# Altium schematic sheet Codec.SchDoc
size A3; DocumentNumber: 3; SheetNumber: 3; SheetTotal: 9
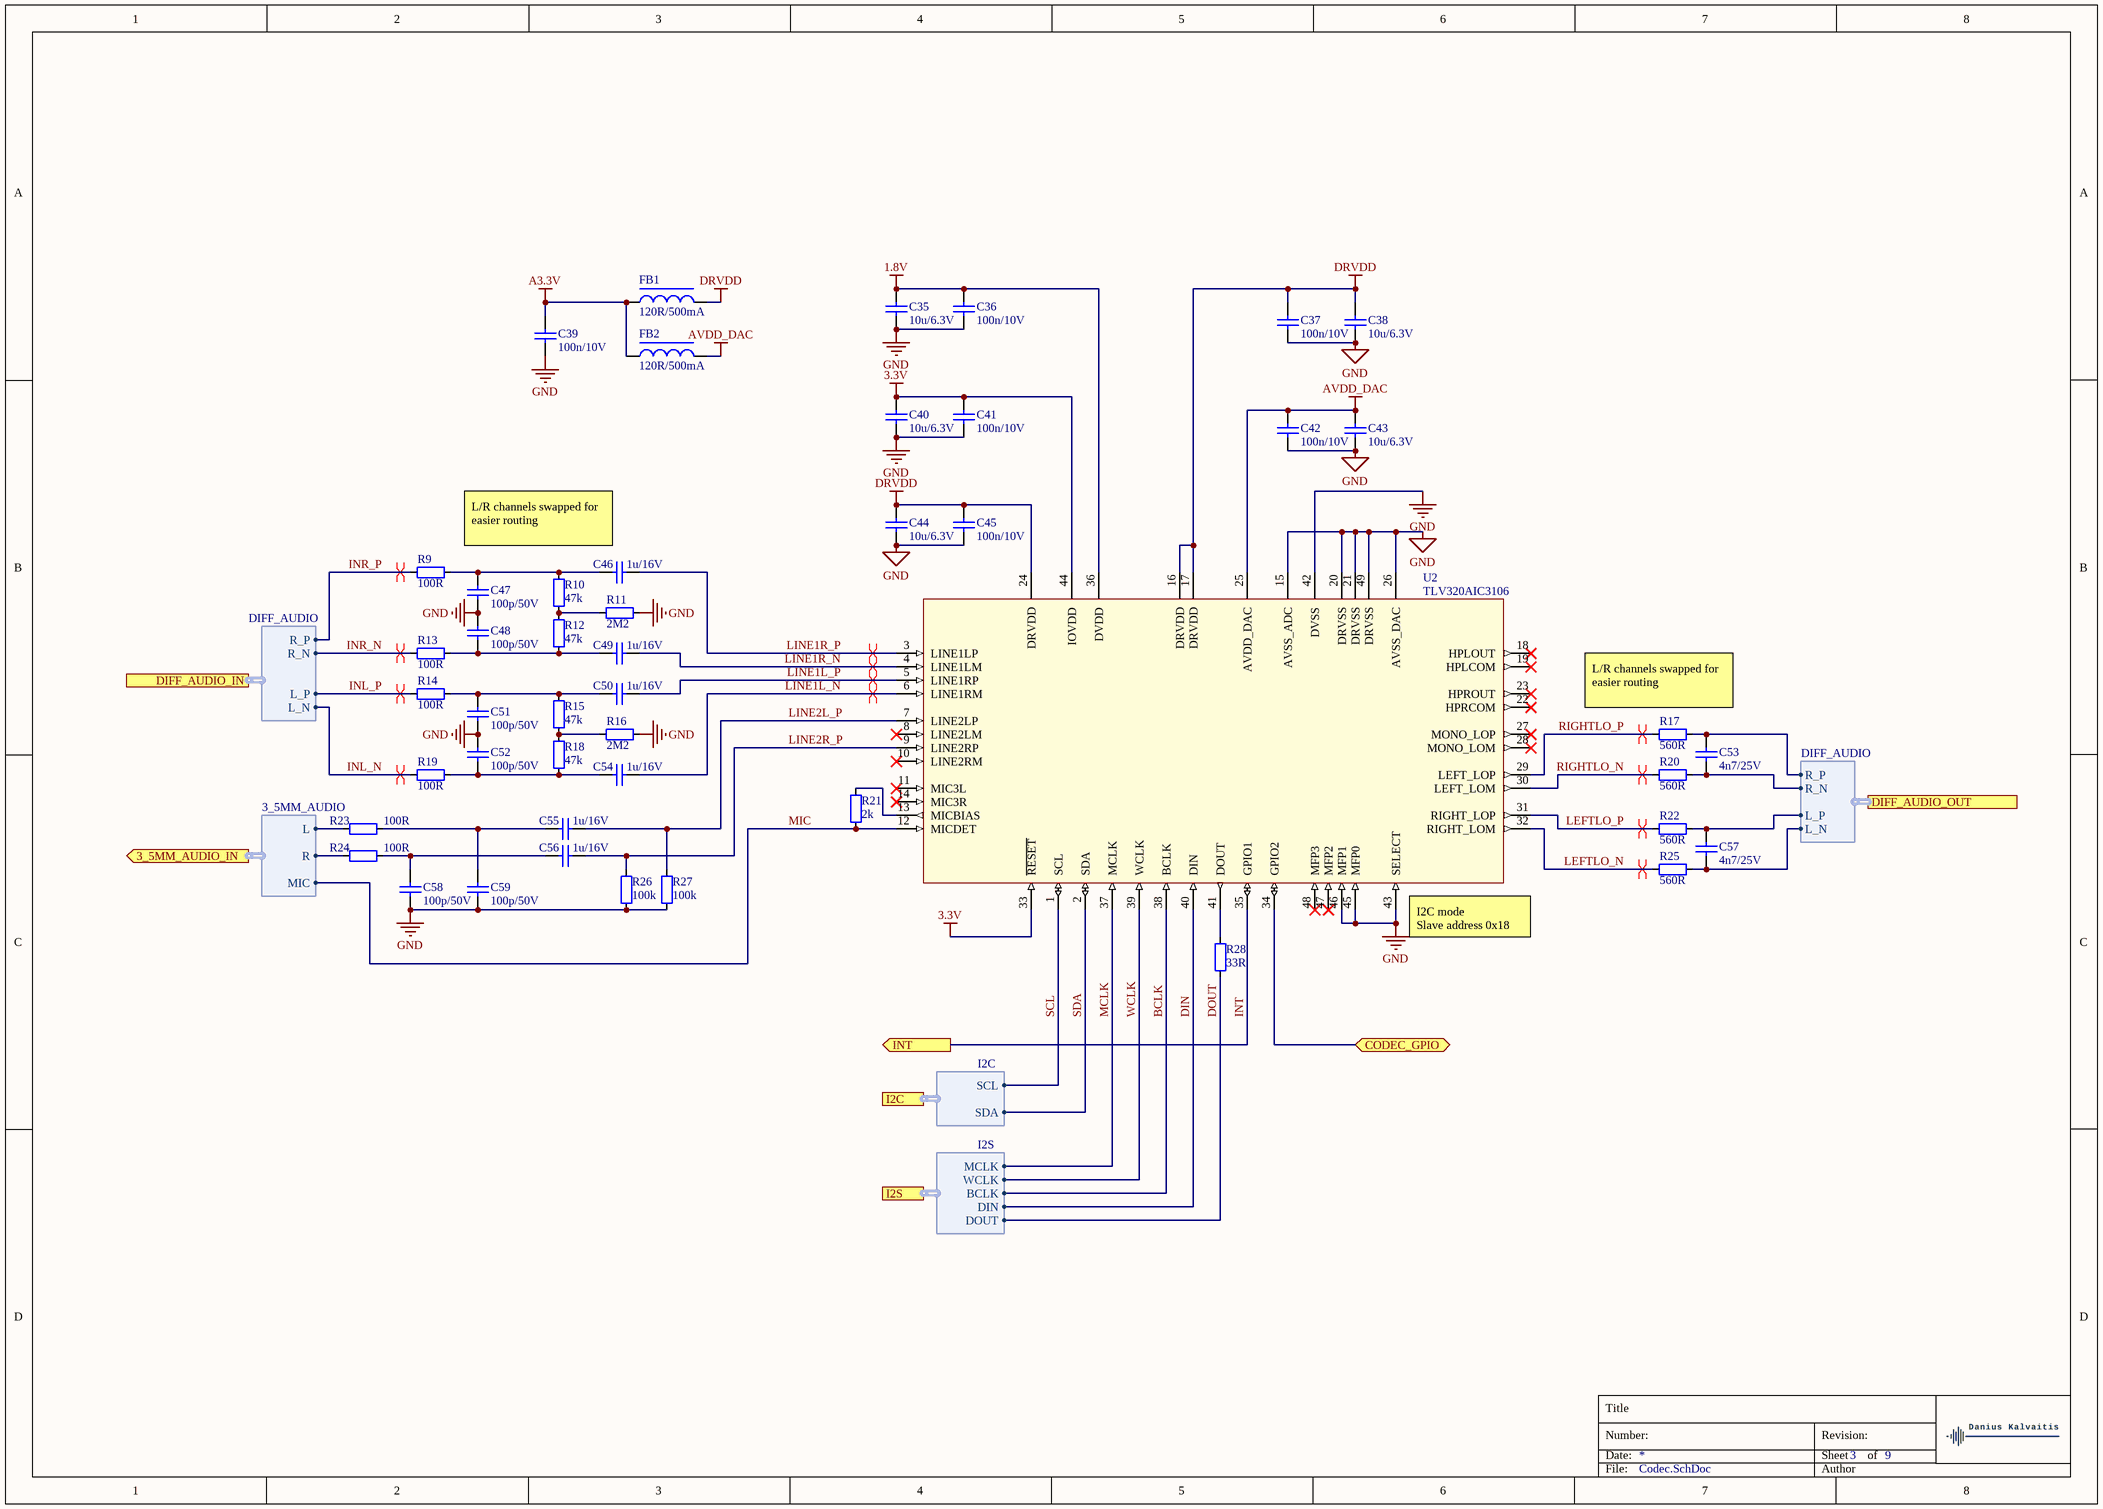
[diagram p0: Codec.SchDoc]

## Parts
C35  10u/6.3V  [C0805]
C36  100n/10V  [C0402]
C37  100n/10V  [C0402]
C38  10u/6.3V  [C0805]
C39  100n/10V  [C0402]
C40  10u/6.3V  [C0805]
C41  100n/10V  [C0402]
C42  100n/10V  [C0402]
C43  10u/6.3V  [C0805]
C44  10u/6.3V  [C0805]
C45  100n/10V  [C0402]
C46  1u/16V  [C0603]
C47  100p/50V  [C0402]
C48  100p/50V  [C0402]
C49  1u/16V  [C0603]
C50  1u/16V  [C0603]
C51  100p/50V  [C0402]
C52  100p/50V  [C0402]
C53  4n7/25V  [C0402]
C54  1u/16V  [C0603]
C55  1u/16V  [C0603]
C56  1u/16V  [C0603]
C57  4n7/25V  [C0402]
C58  100p/50V  [C0402]
C59  100p/50V  [C0402]
FB1  120R/500mA  [FB0402]
FB2  120R/500mA  [FB0402]
R9  100R  [R0402]
R10  47k  [R0402]
R11  2M2  [R0402]
R12  47k  [R0402]
R13  100R  [R0402]
R14  100R  [R0402]
R15  47k  [R0402]
R16  2M2  [R0402]
R17  560R  [R0402]
R18  47k  [R0402]
R19  100R  [R0402]
R20  560R  [R0402]
R21  2k  [R0402]
R22  560R  [R0402]
R23  100R  [R0402]
R24  100R  [R0402]
R25  560R  [R0402]
R26  100k  [R0402]
R27  100k  [R0402]
R28  33R  [R0402]
U2  TLV320AIC3106  [VQFN-48]

## Ports
3_5MM_AUDIO_IN (out, harness 3_5MM_AUDIO), CODEC_GPIO (bidir), DIFF_AUDIO_IN (harness DIFF_AUDIO), DIFF_AUDIO_OUT (harness DIFF_AUDIO), I2C (harness I2C), I2S (harness I2S), INT (out)

## Harnesses
DIFF_AUDIO: L_N, L_P, R_N, R_P
I2C: SCL, SDA
I2S: MCLK, WCLK, BCLK, DIN, DOUT
3_5MM_AUDIO: R, L, MIC

## Nets
1.8V: C35.2 C36.2 U2.36(DVDD)
3.3V: C40.2 C41.2 U2.33(~{RESET}) U2.44(IOVDD)
A3.3V: C39.2 FB1.1 FB2.1
AVDD_DAC: C42.2 C43.2 FB2.2 U2.25(AVDD_DAC)
DRVDD: C37.2 C38.2 C44.2 C45.2 FB1.2 U2.16(DRVDD) U2.17(DRVDD) U2.24(DRVDD)
GND: C35.1 C36.1 C37.1 C38.1 C39.1 C40.1 C41.1 C42.1 C43.1 C44.1 C45.1 C47.1 C48.2 C51.1 C52.2 C58.1 C59.1 R11.2 R16.2 R26.1 R27.1 U2.15(AVSS_ADC) U2.20(DRVSS) U2.21(DRVSS) U2.26(AVSS_DAC) U2.42(DVSS) U2.43(SELECT) U2.45(MFP0) U2.46(MFP1) U2.49(DRVSS)
BCLK: U2.38(BCLK) ; port I2S.BCLK
CODEC_GPIO: U2.34(GPIO2) ; port CODEC_GPIO
DIN: U2.40(DIN) ; port I2S.DIN
DOUT: R28.1 ; port I2S.DOUT
INL_N: R19.1 ; port DIFF_AUDIO_IN.L_N
INL_P: R14.1 ; port DIFF_AUDIO_IN.L_P
INR_N: R13.1 ; port DIFF_AUDIO_IN.R_N
INR_P: R9.1 ; port DIFF_AUDIO_IN.R_P
INT: U2.35(GPIO1) ; port INT
LEFTLO_N: R25.1 U2.32(RIGHT_LOM)
LEFTLO_P: R22.1 U2.31(RIGHT_LOP)
LINE1L_N: C54.1 U2.6(LINE1RM)
LINE1L_P: C50.1 U2.5(LINE1RP)
LINE1R_N: C49.1 U2.4(LINE1LM)
LINE1R_P: C46.1 U2.3(LINE1LP)
LINE2L_P: C55.1 R27.2 U2.7(LINE2LP)
LINE2R_P: C56.1 R26.2 U2.9(LINE2RP)
MCLK: U2.37(MCLK) ; port I2S.MCLK
MIC: R21.1 U2.12(MICDET) ; port 3_5MM_AUDIO_IN.MIC
RIGHTLO_N: R20.1 U2.30(LEFT_LOM)
RIGHTLO_P: R17.1 U2.29(LEFT_LOP)
SCL: U2.1(SCL) ; port I2C.SCL
SDA: U2.2(SDA) ; port I2C.SDA
WCLK: U2.39(WCLK) ; port I2S.WCLK
NetC46_2: C46.2 C47.2 R9.2 R10.2
NetC48_1: C48.1 C49.2 R12.1 R13.2
NetC50_2: C50.2 C51.2 R14.2 R15.2
NetC52_1: C52.1 C54.2 R18.1 R19.2
NetC53_1: C53.1 R20.2 ; port DIFF_AUDIO_OUT.R_N
NetC53_2: C53.2 R17.2 ; port DIFF_AUDIO_OUT.R_P
NetC55_2: C55.2 C59.2 R23.2
NetC56_2: C56.2 C58.2 R24.2
NetC57_1: C57.1 R25.2 ; port DIFF_AUDIO_OUT.L_N
NetC57_2: C57.2 R22.2 ; port DIFF_AUDIO_OUT.L_P
NetR10_1: R10.1 R11.1 R12.2
NetR15_1: R15.1 R16.1 R18.2
NetR21_2: R21.2 U2.13(MICBIAS)
NetR23_1: R23.1 ; port 3_5MM_AUDIO_IN.L
NetR24_1: R24.1 ; port 3_5MM_AUDIO_IN.R
NetR28_2: R28.2 U2.41(DOUT)

Not connected (* = marked no-connect by the designer): U2 8(LINE2LM)* 10(LINE2RM)* 11(MIC3L)* 14(MIC3R)* 18(HPLOUT)* 19(HPLCOM)* 22(HPRCOM)* 23(HPROUT)* 27(MONO_LOP)* 28(MONO_LOM)* 47(MFP2)* 48(MFP3)*

## Layout directives
differential pair: INL_N, INL_P, INR_N, INR_P, LEFTLO_N, LEFTLO_P, LINE1L_N, LINE1L_P, LINE1R_N, LINE1R_P, RIGHTLO_N, RIGHTLO_P

## Notes on the sheet
- L/R channels swapped for easier routing
- (near U2) I2C mode
  Slave address 0x18
- Title
- Date:
- Number:
- Revision:
- Sheet
- of
- File:
- Author

## Library data of the parts
C35 C38 C40 C43 C44 = 10u 6V3 X7R 0805: Manufacturer Part Number 1: JMK212B7106KG-T; Manufacturer 1: Taiyo Yuden; Voltage: 6.3V; Tolerance: 10%; Specifications: X7R 10u 6.3V ±10%; Capacitance: 10u; Dielectric: X7R; Supplier 1: Mouser; Supplier Part Number 1: 963-JMK212B7106KG-T
C36 C37 C39 C41 C42 C45 = 100n 10V X5R 0402: Manufacturer Part Number 1: 885012105010; Manufacturer 1: Wurth Elektronik; Voltage: 10V; Tolerance: 20%; Specifications: X5R 100n 10V ±20%; Capacitance: 100n; Dielectric: X5R; Supplier 1: Mouser; Supplier Part Number 1: 710-885012105010
C46 C49 C50 C54-C56 = 1u 16V X7R 0603: Manufacturer Part Number 1: 885012206052; Manufacturer 1: Wurth Elektronik; Voltage: 16V; Tolerance: 10%; Specifications: X7R 1u 16V ±10%; Capacitance: 1u; Dielectric: X7R; Supplier 1: Mouser; Supplier Part Number 1: 710-885012206052
C47 C48 C51 C52 C58 C59 = 100p 50V C0G 0402: Manufacturer Part Number 1: MC0402N101K500CT; Manufacturer 1: Multicomp PRO; Voltage: 50V; Tolerance: 10%; Specifications: C0G 100p 50V ±10%; Capacitance: 100p; Dielectric: C0G; Supplier 1: Farnell; Supplier Part Number 1: 2320762
C53 C57 = 4n7 25V X7R 0402: Manufacturer Part Number 1: 885012205048; Manufacturer 1: Wurth Elektronik; Voltage: 25V; Tolerance: 10%; Specifications: X7R 4n7 25V ±10%; Capacitance: 4n7; Dielectric: X7R; Supplier 1: Mouser; Supplier Part Number 1: 710-885012205048
FB1 FB2 = BLM15AG121SN1D: 120 Ohms @ 100MHz 1  Ferrite Bead 0402 (1005 Metric) 550mA 190mOhm; Specifications: 120R 500mA 25%; Impedance: 120R; Current: 500mA; Resistance: 250mOhm; Tolerance: 25%; Manufacturer Part Number: BLM15AG121SN1D; Supplier 1: Mouser; Supplier Part Number 1: 81-BLM15AG121SN1D; ComponentLink1Description: Datasheet; ComponentLink1URL: https://www.murata.com/en-us/products/productdata/8796740059166/ENFA0018.pdf
R9 R13 R14 R19 R23 R24 = 100R 63mW 50V 0402: Manufacturer Part Number 1: MCWR04X1000FTL; Manufacturer 1: MULTICOMP PRO; Power Rating: 63mW; Tolerance: 1%; Voltage: 50V; Resistance: 100R; Specifications: =Resistance+ ' '+"Power Rating "+Voltage+' ±'+Tolerance; Supplier 1: Farnell; Supplier Part Number 1: 2447095
R10 R12 R15 R18 = 47k 63mW 50V 0402: Manufacturer Part Number 1: MCWR04X4702FTL; Manufacturer 1: MULTICOMP PRO; Power Rating: 63mW; Tolerance: 1%; Voltage: 50V; Resistance: 47k; Specifications: =Resistance+ ' '+"Power Rating "+Voltage+' ±'+Tolerance; Supplier 1: Farnell; Supplier Part Number 1: 2447179
R11 R16 = 2M2 63mW 50V 0402: Manufacturer Part Number 1: MCWR04W2204FTL; Manufacturer 1: MULTICOMP PRO; Power Rating: 63mW; Tolerance: 1%; Voltage: 50V; Resistance: 2M2; Specifications: =Resistance+ ' '+"Power Rating "+Voltage+' ±'+Tolerance; Supplier 1: Farnell; Supplier Part Number 1: 2447153
R17 R20 R22 R25 = 560R 63mW 50V 0402: Manufacturer Part Number 1: ERJ-2RHD5600X; Manufacturer 1: Panasonic; Power Rating: 63mW; Tolerance: 0.5%; Voltage: 50V; Resistance: 560R; Specifications: =Resistance+ ' '+"Power Rating "+Voltage+' ±'+Tolerance; Supplier 1: Mouser; Supplier Part Number 1: 667-ERJ-2RHD5600X
R21 = 2k 63mW 50V 0402: Manufacturer Part Number 1: MCWR04X2001FTL; Manufacturer 1: MULTICOMP PRO; Power Rating: 63mW; Tolerance: 1%; Voltage: 50V; Resistance: 2k; Specifications: =Resistance+ ' '+"Power Rating "+Voltage+' ±'+Tolerance; Supplier 1: Farnell; Supplier Part Number 1: 2447147
R26 R27 = 100k 63mW 50V 0402: Manufacturer Part Number 1: AC0402FR-07100KL; Manufacturer 1: Yageo; Power Rating: 63mW; Tolerance: 1%; Voltage: 50V; Resistance: 100k; Specifications: =Resistance+ ' '+"Power Rating "+Voltage+' ±'+Tolerance; Supplier 1: Mouser; Supplier Part Number 1: 603-AC0402FR-07100KL
R28 = 33R 63mW 50V 0402: Manufacturer Part Number 1: CRCW040233R0JNEDC; Manufacturer 1: Vishay; Power Rating: 63mW; Tolerance: 5%; Voltage: 50V; Resistance: 33R; Specifications: =Resistance+ ' '+"Power Rating "+Voltage+' ±'+Tolerance; Supplier 1: Mouser; Supplier Part Number 1: 71-CRCW040233R0JNEDC
U2 = TLV320AIC3106: TLV320AIC3106 Low-Power Stereo Audio CODEC for Portable Audio/Telephony; Manufacturer Part Number: TLV320AIC3106IRGZR; Manufacturer 1: Texas Instruments; ComponentLink1Description: Datasheet; ComponentLink1URL: http://www.ti.com/lit/ds/symlink/tlv320aic3106.pdf; Supplier 1: Mouser; Supplier Part Number 1: 595-V320AIC3106IRGZR; Manufacturer Part Number 1: TLV320AIC3106IRGZR; Supplier 2: Ebay; Supplier Part Number 2: https://www.ebay.com/itm/314119689693?hash=item4922fe15dd:g:~7UAAOSwOKRjB0jY&amdata=enc%3AAQAHAAAA4N0kf08Ubw6PpxJ0sV6%2Fq4sxEvBHfILYZT9O%2B3R2ik8SIpR8dyoOz6b3zf4RdB22lZOPJxKqmbMyCk7qr01zOZpZNXsi5rvSdRqY841zB7LnX0sY0vu1g%2BBVDZfZajFxEp3dD2ONrEfVXD5wqt9NyzT46URjKDI7jdn0ZdFMs3h64npPlNRcrem5ckPVJ55rxv%2Fs3XlkADo%2FGQCfajwdfOHJjruZNi6CU7pYfV2h3bJT7kaRjd2DQRrrElCP0bjXFOlURTf%2F7h2f9uVAkJGcyDCv7tpcd70t8wwnktRV1JVY%7Ctkp%3ABk9SR8CIgbTjYA